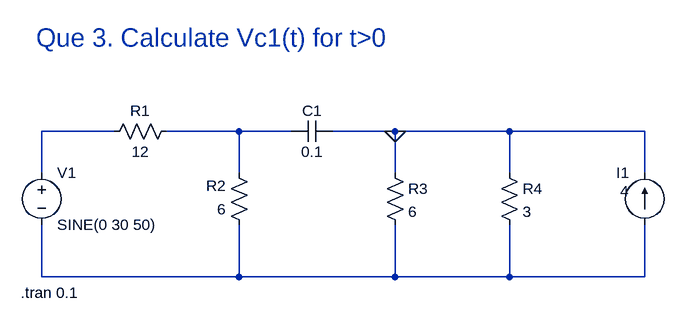
[diagram p0: schematic 3_Dheerendra_23EE019_AC_Transient.asc]
3_Dheerendra_23EE019_AC_Transient.asc, the LTspice schematic file:
Version 4
SHEET 1 948 680
WIRE 96 64 -16 64
WIRE 288 64 176 64
WIRE 368 64 288 64
WIRE 528 64 432 64
WIRE 704 64 528 64
WIRE 912 64 704 64
WIRE -16 128 -16 64
WIRE 288 128 288 64
WIRE 528 128 528 64
WIRE 704 128 704 64
WIRE 912 128 912 64
WIRE -16 288 -16 208
WIRE 288 288 288 208
WIRE 288 288 -16 288
WIRE 528 288 528 208
WIRE 528 288 288 288
WIRE 704 288 704 208
WIRE 704 288 528 288
WIRE 912 288 912 208
WIRE 912 288 704 288
FLAG 528 64 0
SYMBOL voltage -16 112 R0
WINDOW 123 0 0 Left 0
WINDOW 39 0 0 Left 0
SYMATTR InstName V1
SYMATTR Value SINE(0 30 50)
SYMBOL res 192 48 R90
WINDOW 0 0 56 VBottom 2
WINDOW 3 32 56 VTop 2
SYMATTR InstName R1
SYMATTR Value 12
SYMBOL res 304 224 R180
WINDOW 0 36 76 Left 2
WINDOW 3 36 40 Left 2
SYMATTR InstName R2
SYMATTR Value 6
SYMBOL cap 432 48 R90
WINDOW 0 0 32 VBottom 2
WINDOW 3 32 32 VTop 2
SYMATTR InstName C1
SYMATTR Value 0.1
SYMBOL res 512 112 R0
SYMATTR InstName R3
SYMATTR Value 6
SYMBOL res 688 112 R0
SYMATTR InstName R4
SYMATTR Value 3
SYMBOL current 912 208 R180
WINDOW 0 24 80 Left 2
WINDOW 3 24 52 Left 2
WINDOW 123 0 0 Left 0
WINDOW 39 0 0 Left 0
SYMATTR InstName I1
SYMATTR Value 4
TEXT -24 -80 Left 4 ;Que 3. Calculate Vc1(t) for t>0
TEXT -48 312 Left 2 !.tran 0.1

The netlist it stands for:
* 3_Dheerendra_23EE019_AC_Transient.asc
V1 N001 N003 SINE(0 30 50)
R1 N002 N001 12
R2 N003 N002 6
C1 0 N002 0.1
R3 0 N003 6
R4 0 N003 3
I1 N003 0 4
* Que 3. Calculate Vc1(t) for t>0
.tran 0.1
.backanno
.end